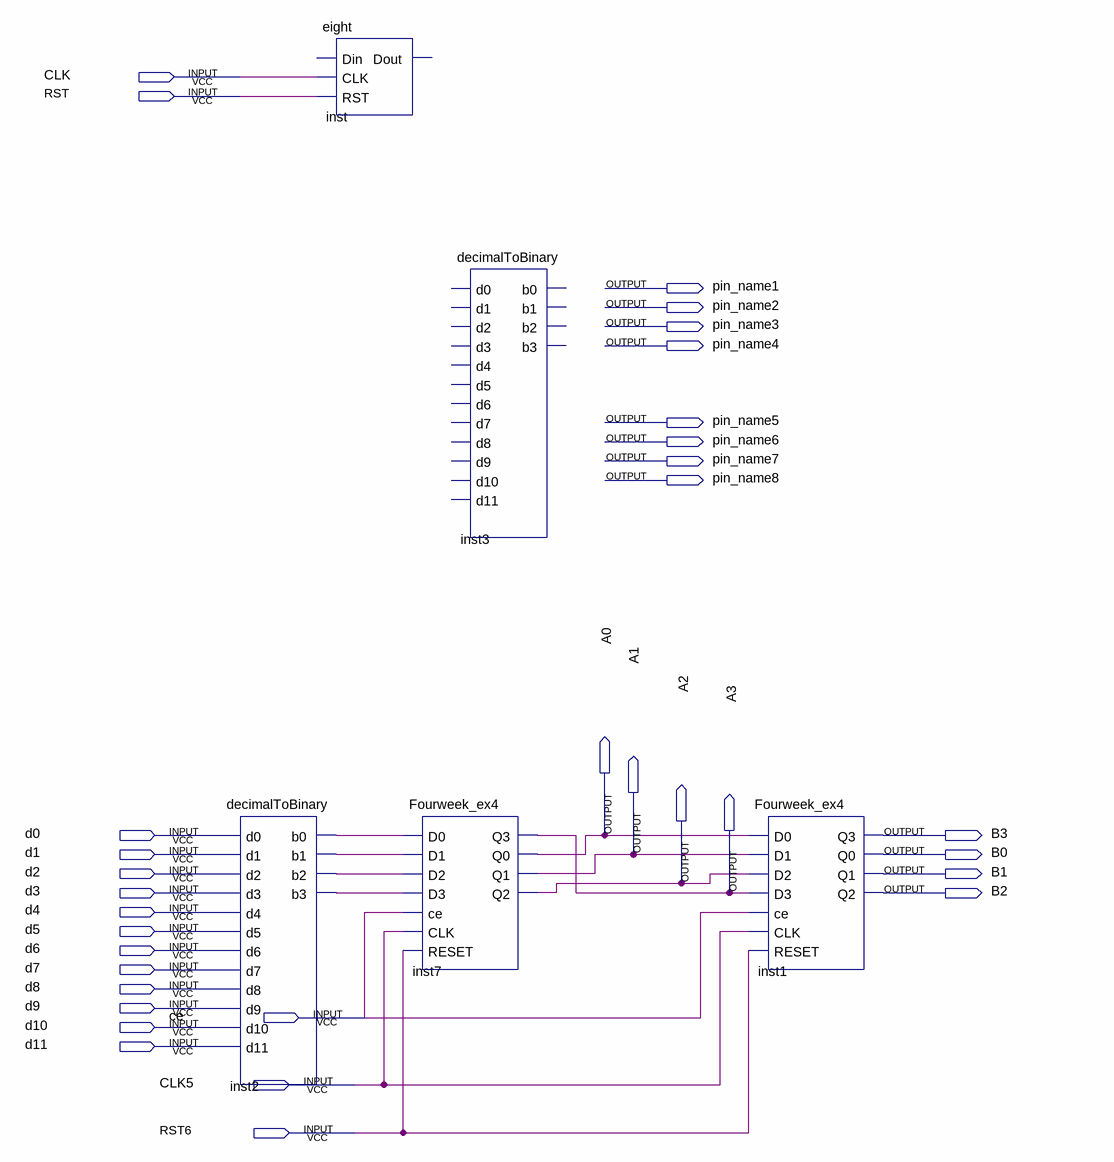
[diagram p0: schematic sheet]
// Quartus schematic tk.bdf as structural Verilog: 5 symbols, 33 pins
module tk (
  input  CLK,
  input  RST,
  input  d0,
  input  d1,
  input  d2,
  input  d3,
  input  d4,
  input  d5,
  input  d6,
  input  d7,
  input  d8,
  input  d9,
  input  ce,
  input  d10,
  input  d11,
  input  CLK5,
  input  RST6,
  output pin_name1,
  output pin_name2,
  output pin_name3,
  output pin_name4,
  output pin_name5,
  output pin_name6,
  output pin_name7,
  output pin_name8,
  output A0,
  output B3,
  output A1,
  output B0,
  output B1,
  output A2,
  output A3,
  output B2
);

  wire inst2_b0, inst2_b1, inst2_b2, inst2_b3;

  decimalToBinary inst2 (
    .d0(d0), .d1(d1), .d2(d2), .d3(d3), .d4(d4), .d5(d5), .d6(d6), .d7(d7), .d8(d8), .d9(d9), .d10(d10),
    .d11(d11), .b0(inst2_b0), .b1(inst2_b1), .b2(inst2_b2), .b3(inst2_b3));
  eight inst (.CLK(CLK), .RST(RST));  // open: Din, Dout
  decimalToBinary inst3 ();  // open: d0, d1, d2, d3, d4, d5, d6, d7, d8, d9, d10, d11, b0, b1, b2, b3
  Fourweek_ex4 inst7 (
    .D0(inst2_b0), .D1(inst2_b1), .D2(inst2_b2), .D3(inst2_b3), .ce(ce), .CLK(CLK5), .RESET(RST6), .Q3(A3),
    .Q0(A0), .Q1(A1), .Q2(A2));
  Fourweek_ex4 inst1 (
    .D0(A0), .D1(A1), .D2(A2), .D3(A3), .ce(ce), .CLK(CLK5), .RESET(RST6), .Q3(B3), .Q0(B0), .Q1(B1), .Q2(B2));
endmodule
